# Altium schematic sheet Ring 5.SchDoc
size A; SheetNumber: 21; SheetTotal: 30
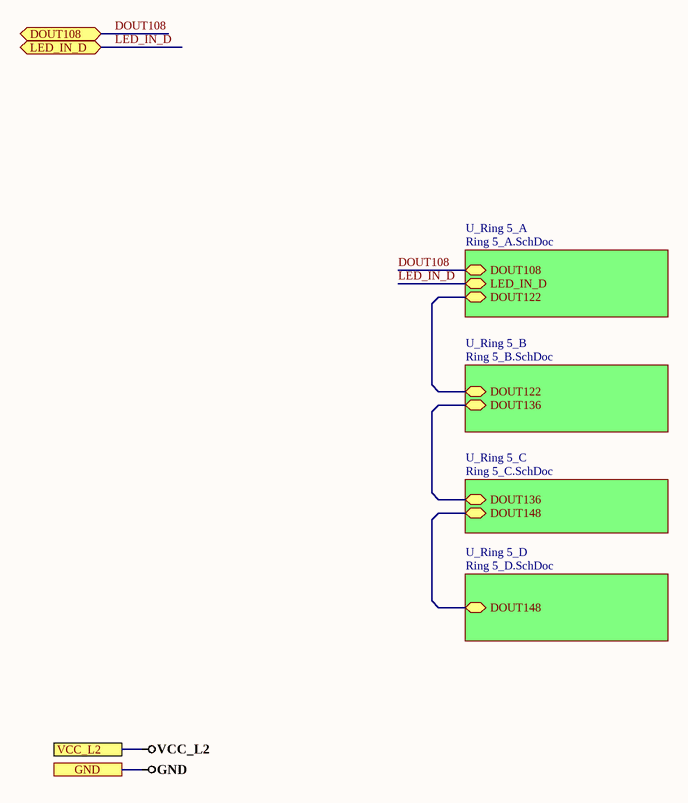
[diagram p0: Ring 5.SchDoc]

## Sub-sheets
U_Ring 5_A = Ring 5_A.SchDoc: DOUT122 (bidir), DOUT108 (bidir), LED_IN_D (bidir)
U_Ring 5_B = Ring 5_B.SchDoc: DOUT122 (bidir), DOUT136 (bidir)
U_Ring 5_C = Ring 5_C.SchDoc: DOUT148 (bidir), DOUT136 (bidir)
U_Ring 5_D = Ring 5_D.SchDoc: DOUT148 (bidir)

## Ports
DOUT108 (bidir), GND, LED_IN_D (bidir), VCC_L2

## Nets
GND: port GND
VCC_L2: port VCC_L2
DOUT108: port DOUT108, sheet U_Ring 5_A/DOUT108
LED_IN_D: port LED_IN_D, sheet U_Ring 5_A/LED_IN_D
(unnamed): sheet U_Ring 5_A/DOUT122, sheet U_Ring 5_B/DOUT122
(unnamed): sheet U_Ring 5_B/DOUT136, sheet U_Ring 5_C/DOUT136
(unnamed): sheet U_Ring 5_C/DOUT148, sheet U_Ring 5_D/DOUT148